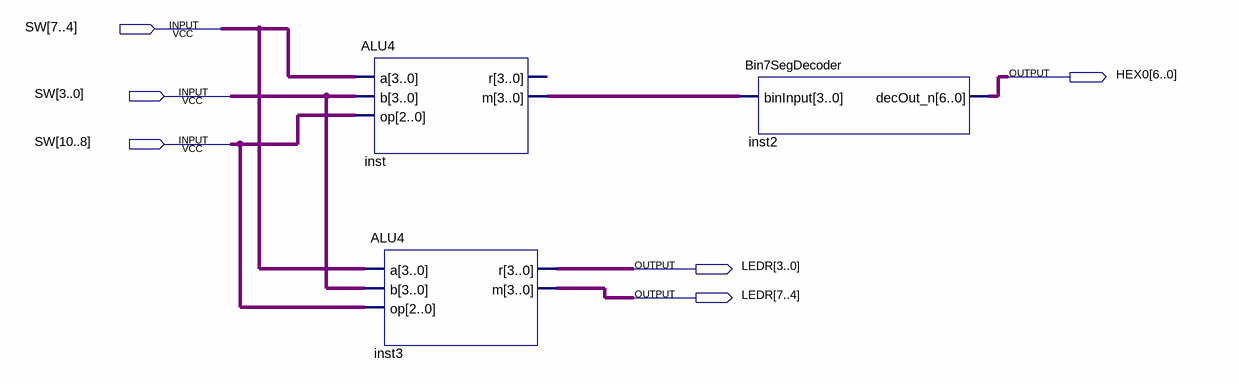
[diagram p0: schematic sheet]
// Quartus schematic ALUDemo_mdysplay.bdf as structural Verilog: 3 symbols, 6 pins
module ALUDemo_mdysplay (
  input  [10:0] SW,
  output [6:0] HEX0,
  output [7:0] LEDR
);

  wire [3:0] inst_m;

  ALU4 inst (.a(SW[7:4]), .b(SW[3:0]), .op(SW[10:8]), .m(inst_m));  // open: r
  ALU4 inst3 (.a(SW[7:4]), .b(SW[3:0]), .op(SW[10:8]), .r(LEDR[3:0]), .m(LEDR[7:4]));
  Bin7SegDecoder inst2 (.binInput(inst_m), .decOut_n(HEX0));
endmodule
